# Altium schematic sheet INA3221 Current Sensor.SchDoc
size A4
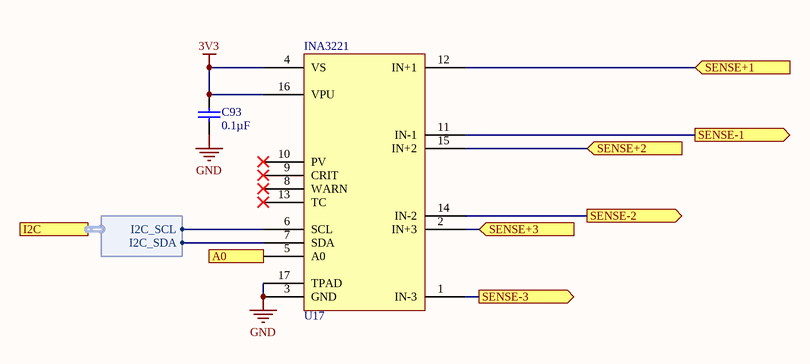
[diagram p0: INA3221 Current Sensor.SchDoc]

## Parts
C93  value 0.1µF  [TDK-CGA2B]  (hidden comment: Cap)
U17  INA3221  [TI-RGV]

## Ports
A0 (in), I2C (harness INA226_I2C), SENSE+1 (in), SENSE+2 (in), SENSE+3 (in), SENSE-1 (out), SENSE-2 (out), SENSE-3 (out)

## Harnesses
INA226_I2C: I2C_SCL, I2C_SDA

## Nets
3V3: C93.2 U17.4(VS) U17.16(VPU)
GND: C93.1 U17.3(GND) U17.17(TPAD)
A0: U17.5(A0) ; port A0
SENSE+1: U17.12(IN+1) ; port SENSE+1
SENSE+2: U17.15(IN+2) ; port SENSE+2
SENSE+3: U17.2(IN+3) ; port SENSE+3
SENSE-1: U17.11(IN-1) ; port SENSE-1
SENSE-2: U17.14(IN-2) ; port SENSE-2
SENSE-3: U17.1(IN-3) ; port SENSE-3
NetU17_6: U17.6(SCL) ; port I2C.I2C_SCL
NetU17_7: U17.7(SDA) ; port I2C.I2C_SDA

Not connected (* = marked no-connect by the designer): U17 8(WARN)* 9(CRIT)* 10(PV)* 13(TC)*

## Library data of the parts
C93 = PC-TDK-02262: CAP CER 0.1UF 50V X7R 0402; Manufacturer Part Number: CGA2B3X7R1H104M050BB; Index: 2262; Designator: C?; Tolerance: ±20%; Published: 3/16/2016; LatestRevisionDate: 3/16/2016; LatestRevisionNote: ...; PackageReference: 0402 (1005 Metric); Publisher: AlbertaSat; PackageDescription: Radial Cap, Thru-Hole; 2 Leads; 0.3 in Pin Spacing; Part Number: PC-TDK-02262; Supplier Part Number 1: 445-12271-1-ND; Supplier 1: Digi-key; Supplier Link: http://www.digikey.ca/product-search/en?keywords=445-12271-1-ND; Voltage - Rated: 50V; Temperature Coefficient: X7R; Applications: Automotive
U17 = 39: IC CURRENT SHUNT MONITOR 16VQFN; Part Number: 39; Manufacturer Part Number: INA3221AQRGVRQ1; Designator: U?; Supplier Part Number 1: 296-44112-1-ND; Supplier 1: Digi-Key; Supplier Link: #https://www.digikey.ca/products/en/integrated-circuits-ics/pmic-current-regulation-management/734?k=ina3221&k=&pkeyword=ina3221&pv7=2&s=39106&FV=ffe002de&mnonly=0&ColumnSort=0&page=1&quantity=0&ptm=0&fid=0&pageSize=25#; PackageReference: TI-VQFN16